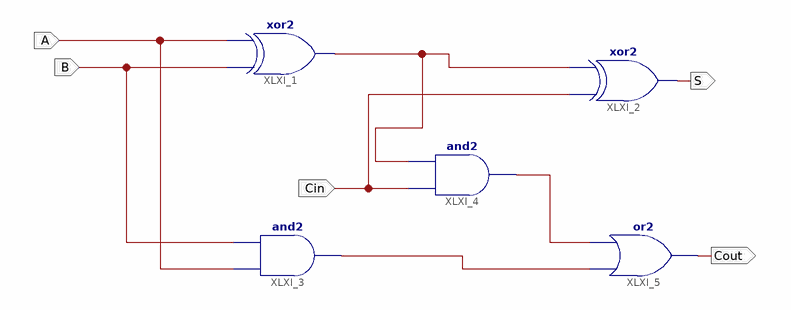
[diagram p0: schematic sheet 1]
// Xilinx ISE schematic fullAdder.sch (spartan3e) as structural Verilog: 5 symbols, 5 ports
module fullAdder (
  input  A,
  input  Cin,
  input  B,
  output S,
  output Cout
);

  wire XLXN_7, XLXN_9, XLXN_10;

  xor XLXI_1 (XLXN_7, B, A);
  xor XLXI_2 (S, Cin, XLXN_7);
  and XLXI_3 (XLXN_10, A, B);
  and XLXI_4 (XLXN_9, Cin, XLXN_7);
  or XLXI_5 (Cout, XLXN_10, XLXN_9);
endmodule
